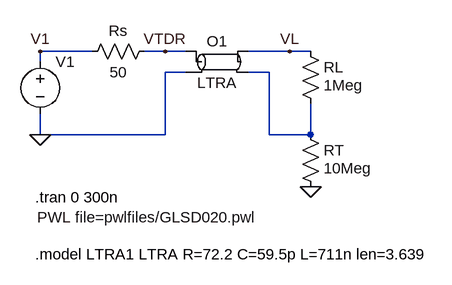
[diagram p0: schematic tdr_4mucryomanginintwp_open_shieldconnvsfloating_fcngen33250a.asc]
tdr_4mucryomanginintwp_open_shieldconnvsfloating_fcngen33250a.asc, the LTspice schematic file:
Version 4
SHEET 1 1272 680
WIRE 16 144 -64 144
WIRE 128 144 96 144
WIRE 160 144 128 144
WIRE 320 144 256 144
WIRE 352 144 320 144
WIRE -64 160 -64 144
WIRE 160 176 128 176
WIRE 288 176 256 176
WIRE -64 272 -64 240
WIRE 128 272 128 176
WIRE 128 272 -64 272
WIRE 288 272 288 176
WIRE 352 272 352 224
WIRE 352 272 288 272
FLAG -64 272 0
FLAG 320 144 VL
FLAG -64 144 V1
FLAG 128 144 VTDR
FLAG 352 352 0
SYMBOL res 112 128 R90
WINDOW 0 0 56 VBottom 2
WINDOW 3 32 56 VTop 2
SYMATTR InstName Rs
SYMATTR Value 50
SYMBOL voltage -64 144 R0
WINDOW 123 0 0 Left 0
WINDOW 39 0 0 Left 0
WINDOW 3 -5 255 Left 2
SYMATTR Value PWL file=pwlfiles/GLSD020.pwl
SYMATTR InstName V1
SYMBOL res 336 128 R0
WINDOW 3 36 68 Left 2
SYMATTR Value 1Meg
SYMATTR InstName RL
SYMBOL ltline 208 160 R0
SYMATTR InstName O1
SYMATTR SpiceModel LTRA1
SYMBOL res 336 256 R0
WINDOW 3 36 68 Left 2
SYMATTR Value 10Meg
SYMATTR InstName RT
TEXT -72 368 Left 2 !.tran 0 300n
TEXT -72 456 Left 2 !.model LTRA1 LTRA R=72.2 C=59.5p L=711n len=3.639

The netlist it stands for:
* tdr_4mucryomanginintwp_open_shieldconnvsfloating_fcngen33250a.asc
Rs VTDR V1 50
V1 V1 0 PWL file=pwlfiles/GLSD020.pwl
RL VL N001 1Meg
O1 VTDR 0 VL N001 LTRA1 LTRA
RT N001 0 10Meg
.tran 0 300n
.model LTRA1 LTRA R=72.2 C=59.5p L=711n len=3.639
.backanno
.end